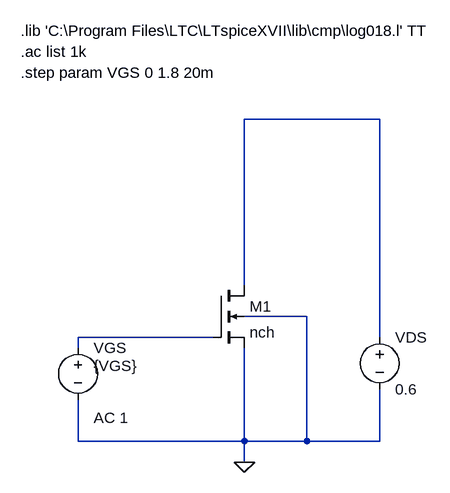
[diagram p0: schematic Week1_Ex3A.asc]
Week1_Ex3A.asc, the LTspice schematic file:
Version 4
SHEET 1 880 680
WIRE 416 80 208 80
WIRE 208 336 208 80
WIRE 304 384 208 384
WIRE 160 416 -48 416
WIRE 416 416 416 80
WIRE -48 432 -48 416
WIRE -48 576 -48 512
WIRE 208 576 208 432
WIRE 208 576 -48 576
WIRE 304 576 304 384
WIRE 304 576 208 576
WIRE 416 576 416 496
WIRE 416 576 304 576
WIRE 208 608 208 576
FLAG 208 608 0
SYMBOL nmos4 160 336 R0
SYMATTR InstName M1
SYMATTR Value nch
SYMATTR Value2 l=2u w=4u
SYMBOL voltage -48 416 R0
WINDOW 123 24 124 Left 2
WINDOW 39 0 0 Left 0
WINDOW 3 24 44 Left 2
SYMATTR Value2 AC 1
SYMATTR Value {VGS}
SYMATTR InstName VGS
SYMBOL voltage 416 400 R0
WINDOW 123 0 0 Left 0
WINDOW 39 0 0 Left 0
SYMATTR InstName VDS
SYMATTR Value 0.6
TEXT -136 -56 Left 2 !.lib 'C:\\Program Files\\LTC\\LTspiceXVII\\lib\\cmp\\log018.l' TT
TEXT -136 -24 Left 2 !.ac list 1k
TEXT -136 8 Left 2 !.step param VGS 0 1.8 20m

The netlist it stands for:
* Week1_Ex3A.asc
M1 N001 N002 0 0 nch l=2u w=4u
VGS N002 0 {VGS} AC 1
VDS N001 0 0.6
.model NMOS NMOS
.model PMOS PMOS
.lib standard.mos
.lib 'C:\Program Files\LTC\LTspiceXVII\lib\cmp\log018.l' TT
.ac list 1k
.step param VGS 0 1.8 20m
.backanno
.end